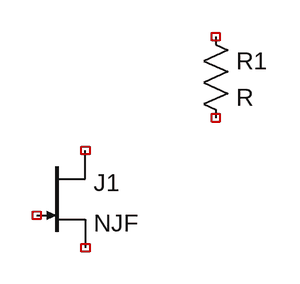
[diagram p0: schematic preamp.asc]
preamp.asc, the LTspice schematic file:
Version 4
SHEET 1 880 680
SYMBOL res 48 224 R0
SYMATTR InstName R1
SYMBOL njf -112 352 R0
SYMATTR InstName J1

The netlist it stands for:
* preamp.asc
R1 NC_01 NC_02 R
J1 NC_03 NC_04 NC_05 NJF
.model NJF NJF
.model PJF PJF
.lib standard.jft
.backanno
.end